# Altium schematic sheet SAU-G0-EX_MAX31865.SchDoc
size A4
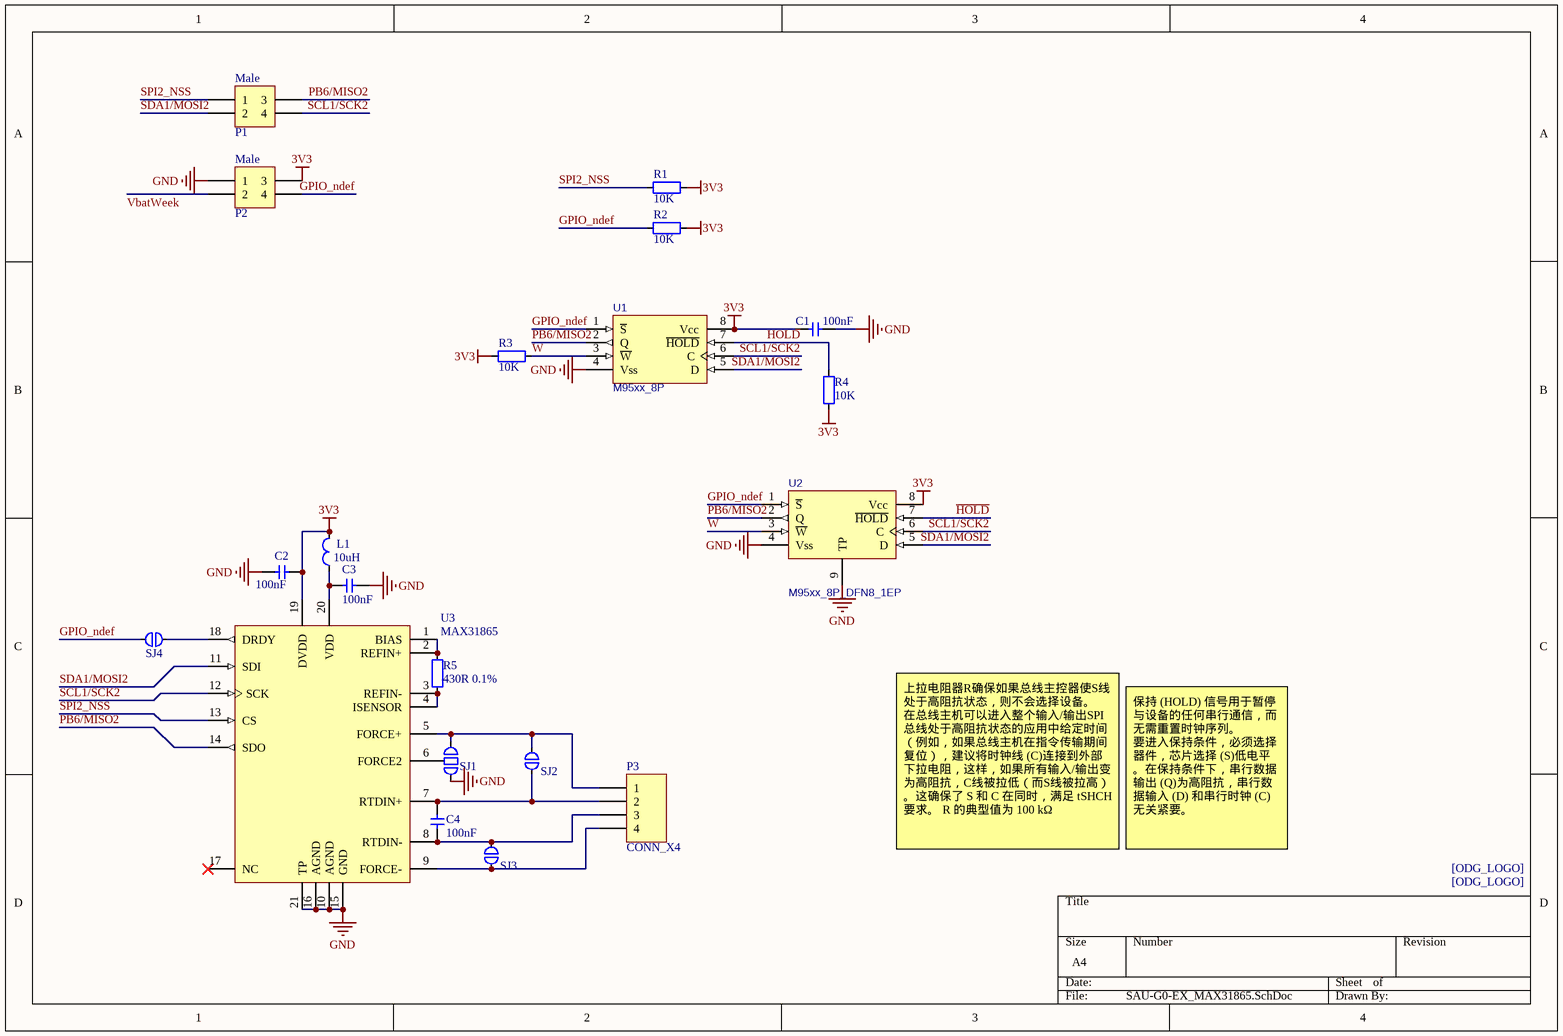
[diagram p0: SAU-G0-EX_MAX31865.SchDoc]

## Parts
C1  100nF  [C0402]
C2  100nF  [C0402]
C3  100nF  [C0402]
C4  100nF  [C0402]
L1  10uH  [FER0603]
ODG1  ODG_LOGO  [ODG_LOGO_soldermask]  (value not drawn)
ODG2  ODG_LOGO  [ODG_LOGO_soldermask]  (value not drawn)
P1  Male  [2.0mm_Male_2x2]
P2  Male  [2.0mm_Male_2x2]
P3  CONN_X4  [2.54mm_Male_x4]
R1  10K  [R0402]
R2  10K  [R0402]
R3  10K  [R0402]
R4  10K  [R0402]
R5  430R 0.1%  [R0603]
SJ1  SJ_3P  [SJ_3P]  (value not drawn)
SJ2  SJ_2P  [SJ_2P]  (value not drawn)
SJ3  SJ_2P  [SJ_2P]  (value not drawn)
SJ4  SJ_2P  [SJ_2P]  (value not drawn)
U1  M95xx_8P  [ANALOG DEV SOIC-8 R8]
U2  M95xx_8P_DFN8_1EP  [DFN-8-1EP_3x2mm_P0.5mm_EP1.75x1.45mm]
U3  MAX31865  [VQFN-20 5x5MM 0.65]

## Nets
3V3: C1.2 C2.1 L1.2 P2.3 R1.2 R2.2 R3.2 R4.2 U1.8(Vcc) U2.8(Vcc) U3.19(DVDD)
GND: C1.1 C2.2 C3.2 P2.1 SJ1.3 U1.4(Vss) U2.4(Vss) U2.9(TP) U3.10(AGND) U3.15(GND) U3.16(AGND) U3.21(TP)
GPIO_ndef: P2.4 R2.1 SJ4.2 U1.1(~{S}) U2.1(~{S})
~{HOLD}: R4.1 U1.7(~{HOLD}) U2.7(~{HOLD})
PB6/MISO2: P1.3 U1.2(Q) U2.2(Q) U3.14(SDO)
SCL1/SCK2: P1.4 U1.6(C) U2.6(C) U3.12(SCK)
SDA1/MOSI2: P1.2 U1.5(D) U2.5(D) U3.11(SDI)
SPI2_NSS: P1.1 R1.1 U3.13(CS)
VbatWeek: P2.2
~{W}: R3.1 U1.3(~{W}) U2.3(~{W})
NetC3_1: C3.1 L1.1 U3.20(VDD)
NetC4_1: C4.1 P3.2 SJ2.2 U3.7(RTDIN+)
NetC4_2: C4.2 P3.3 SJ3.1 U3.8(RTDIN-)
NetP3_1: P3.1 SJ1.1 SJ2.1 U3.5(FORCE+)
NetP3_4: P3.4 SJ3.2 U3.9(FORCE-)
NetR5_1: R5.1 U3.3(REFIN-) U3.4(ISENSOR)
NetR5_2: R5.2 U3.1(BIAS) U3.2(REFIN+)
NetSJ1_2: SJ1.2 U3.6(FORCE2)
NetSJ4_1: SJ4.1 U3.18(DRDY)

Not connected (* = marked no-connect by the designer): U3 17(NC)*

## Notes on the sheet
- 上拉电阻器R确保如果总线主控器使S线处于高阻抗状态，则不会选择设备。
  在总线主机可以进入整个输入/输出SPI总线处于高阻抗状态的应用中给定时间（例如，如果总线主机在指令传输期间复位），建议将时钟线 (C)连接到外部下拉电阻，这样，如果所有输入/输出变为高阻抗，C线被拉低（而S线被拉高）。这确保了 S 和 C 在同时，满足 tSHCH 要求。 R 的典型值为 100 kΩ
- 保持 (HOLD) 信号用于暂停与设备的任何串行通信，而无需重置时钟序列。
  要进入保持条件，必须选择器件，芯片选择 (S)低电平。在保持条件下，串行数据输出 (Q)为高阻抗，串行数据输入 (D) 和串行时钟 (C) 无关紧要。
- (in symbol ODG_LOGO) [ODG_LOGO]

## Library data of the parts
C1-C4 = CAP: Capacitor; Value: 0.1u
L1 = inductor_mini: 贴片叠层电感
P1 P2 = CONN_2X2
R1-R5 = RES: Resistor; Value: 22R
SJ1 = SJ_3P: 焊接跳线二选一
SJ2-SJ4 = SJ_2P: 焊接跳线
U1 = M95xx_8P: Serial SPI bus EEPROM with high-speed clock
U2 = M95xx_8P_DFN8_1EP: Serial SPI bus EEPROM with high-speed clock